# EAGLE design week7-small-noftdi (EAGLE 8.6.0)
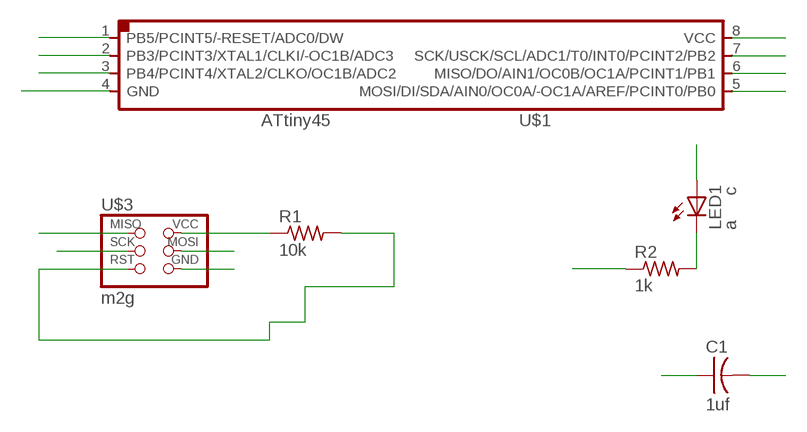
[diagram p0: schematic, sheet 1]

## Parts
C1  1uf  CAP-US1206FAB  [C1206FAB]
LED1  a c  LEDFAB1206  [LED1206FAB]
R1  10k  RES-US1206FAB  [R1206FAB]
R2  1k  RES-US1206FAB  [R1206FAB]
U$1  tt45  ATTINY45SI  [SOIC8]
U$3  m2g  AVRISPSMD  [2X03SMD]

## Nets
GND: C1.2 R2.1 U$1.4(GND) U$3.6(GND)
MISO: U$1.6(MISO/DO/AIN1/OC0B/OC1A/PCINT1/PB1) U$3.1(MISO)
MOSI: U$1.5(MOSI/DI/SDA/AIN0/OC0A/-OC1A/AREF/PCINT0/PB0) U$3.4(MOSI)
N$1: LED1.2(C) R2.2
RST: R1.2 U$1.1(PB5/PCINT5/-RESET/ADC0/DW) U$3.5(RST)
SCK: U$1.7(SCK/USCK/SCL/ADC1/T0/INT0/PCINT2/PB2) U$3.3(SCK)
VCC: C1.1 R1.1 U$1.8(VCC) U$3.2(VCC)
XTAL1: LED1.1(A) U$1.2(PB3/PCINT3/XTAL1/CLKI/-OC1B/ADC3)
XTAL2: U$1.3(PB4/PCINT4/XTAL2/CLKO/OC1B/ADC2)

## Library data of the parts
C1 = fab:CAP-US
LED1 = fab:LED: LED
R1 R2 = fab:RES-US: Resistor (US Symbol) Variants with postfix FAB are widened to allow the routing of internal traces
U$1 = fab:ATTINY45
U$3 = fab:AVRISP

## Net classes
0 default: width 0.4 mm, drill 0.4 mm, clearance 0.4 mm

## Board
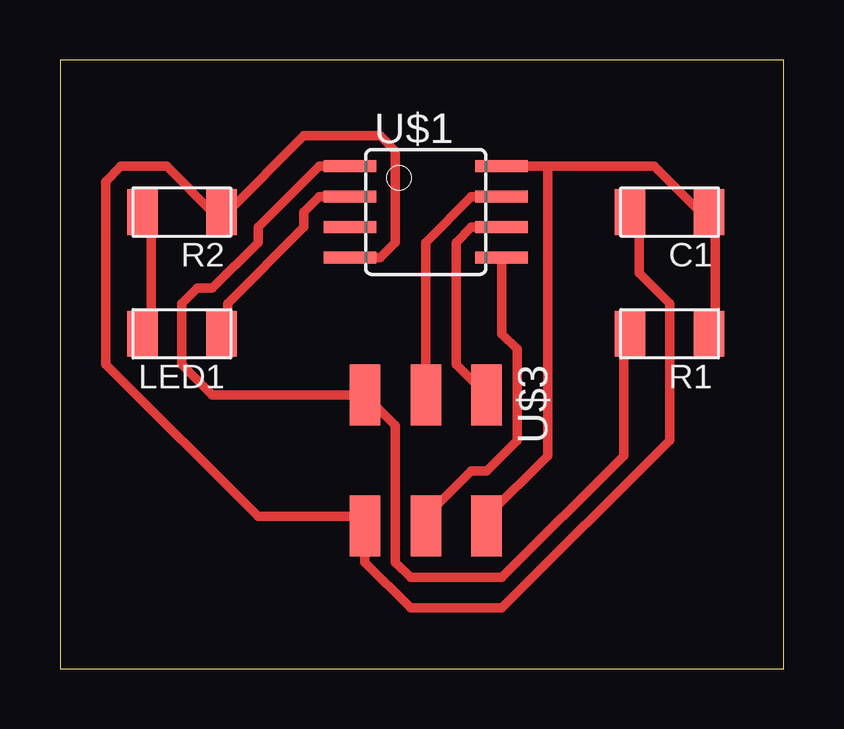
[diagram p1: board, top side]

Size 30.15 x 25.39 mm. Coordinates in mm from the lower left corner, seen from the top.
Outline: 0,0 30.15,0 30.15,25.39 0,25.39 0,0
Copper layers (1*16): Top 0.035mm / dielectric 1.5mm / Bottom 0.035mm
Design rules "default": minimum track width 6mil, minimum drill 0.35mm, track to track 6mil, track to pad 6mil, pad to pad 6mil, via to via 6mil, smd to smd 6mil, copper to edge 40mil, drill to drill 6mil, minimum pad ring 10mil, minimum via ring 8mil, stop-mask expansion 4mil, vias tented up to drill 0mil, thermal gap 10mil

### Footprints (pad centres in the part's own frame; a part is rotated, then mirrored left to right if it is on the bottom)
C1206FAB = smd 1.27 x 1.905: 1 -1.651,0; 2 1.651,0
LED1206FAB = smd 1.27 x 1.905: 1 -1.651,0; 2 1.651,0
R1206FAB = smd 1.27 x 1.905: 1 -1.651,0; 2 1.651,0
SOIC8 = smd 0.5 x 2.2: 1 -1.905,-3.154; 2 -0.645,-3.154; 3 0.625,-3.154; 4 1.895,-3.154; 5 1.905,3.154; 6 0.635,3.154; 7 -0.635,3.154; 8 -1.905,3.154
2X03SMD = smd 2.54 x 1.27: 1 -2.54,2.54; 2 2.92,2.54; 3 -2.54,0; 4 2.92,0; 5 -2.54,-2.54; 6 2.92,-2.54

### Placement (x,y rotation side)
C1  25.4,19.05 180 top
LED1  5.08,13.97 180 top
R1  25.4,13.97 180 top
R2  5.08,19.05 180 top
U$1  15.24,19.05 270 top
U$3  15.24,8.89 270 top

### Tracks (layer width: path | path; a pad name or v marks a point on that pad's centre or on a via)
GND
  Top 0.4: U$1.4 12.7,17.14 13.34,17.14 13.97,17.78 13.97,21.59 13.34,22.23 10.16,22.23 6.99,19.05 R2.1 6.35,19.05 4.45,20.95 2.54,20.95 1.91,20.32 1.91,12.7 8.26,6.35 12.7,6.35 U$3.6 12.7,4.45 14.61,2.54 18.41,2.54 25.4,9.53 25.4,15.24 24.13,16.51 24.13,19.05 C1.2
MISO
  Top 0.4: U$1.6 17.14,18.41 16.51,17.78 16.51,12.7 U$3.1
MOSI
  Top 0.4: U$1.5 18.41,17.14 18.41,13.97 19.05,13.34 19.05,9.53 17.78,8.26 17.14,8.26 15.24,6.35 U$3.4
N$1
  Top 0.4: LED1.2 3.81,13.97 3.81,19.05 R2.2
RST
  Top 0.4: R1.2 23.5,13.97 23.5,8.89 18.41,3.81 14.61,3.81 13.97,4.45 13.97,10.16 U$3.5 6.35,11.43 5.08,12.7 5.08,15.24 5.71,15.88 6.35,15.88 8.26,17.78 8.26,18.41 10.79,20.95 U$1.1
SCK
  Top 0.4: U$1.7 17.14,19.68 15.24,17.78 U$3.3
VCC
  Top 0.4: R1.1 27.3,13.97 27.3,19.05 C1.1 26.67,19.05 24.77,20.95 20.32,20.95 | 20.32,20.95 U$1.8 | 20.32,20.95 20.32,8.89 17.78,6.35 U$3.2
XTAL1
  Top 0.4: LED1.1 6.99,13.97 6.99,15.24 10.16,18.41 10.16,19.05 10.79,19.68 12.06,19.68 U$1.2